# Altium schematic sheet tempbord.SchDoc
size A4
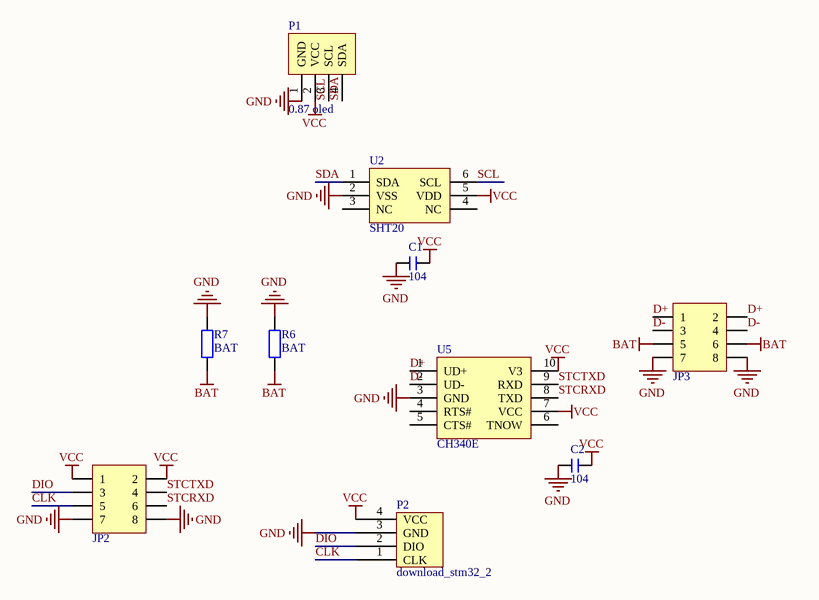
[diagram p0: tempbord.SchDoc]

## Parts
C1  104  [C 0603_L]
C2  104  [C 0603_L]
JP2  Header 4X2  [HDR1.27-LS-2x4P]  (value not drawn)
JP3  Header 4X2  [HDR1.27-M-LS-2x4P]  (value not drawn)
P1  0.87 oled  [0.87 oled]
P2  download_stm32_2  [download_round_1.27_stm32 - 2]
R6  BAT  [R 0805_L]
R7  BAT  [R 0805_L]
U2  SHT20  [DFN6 3*3]
U5  CH340E  [MSOP10_L]

## Nets
BAT: JP3.5 JP3.6 R6.1 R7.1
GND: C1.1 C2.1 JP2.7 JP2.8 JP3.7 JP3.8 P1.1(GND) P2.3(GND) R6.2 R7.2 U2.2(VSS) U5.3(GND)
VCC: C1.2 C2.2 JP2.1 JP2.2 P1.2(VCC) P2.4(VCC) U2.5(VDD) U5.7(VCC) U5.10(V3)
CLK: JP2.5 P2.1(CLK)
D+: JP3.1 JP3.2 U5.1(UD+)
D-: JP3.3 JP3.4 U5.2(UD-)
DIO: JP2.3 P2.2(DIO)
SCL: P1.3(SCL) U2.6(SCL)
SDA: P1.4(SDA) U2.1(SDA)
STCRXD: JP2.6 U5.8(TXD)
STCTXD: JP2.4 U5.9(RXD)

Not connected (* = marked no-connect by the designer): U2 3(NC) 4(NC); U5 4(RTS#) 5(CTS#) 6(TNOW)

## Library data of the parts
C1 C2 = C: 无极性贴片电容; 版权归属: 源创客; BOM名称: 无极性贴片电容; 学习资源: www.ooocke.com
JP2 JP3 = Header 4X2: 4*2P接插件; 版权归属: 源创客; BOM名称: 4*2P接插件; 学习资源: www.ooocke.com
R6 R7 = R: 贴片电阻; 版权归属: 源创客; BOM名称: 贴片电阻; 学习资源: www.ooocke.com